# EAGLE design ezo_single_smaller (EAGLE 9.6.2)
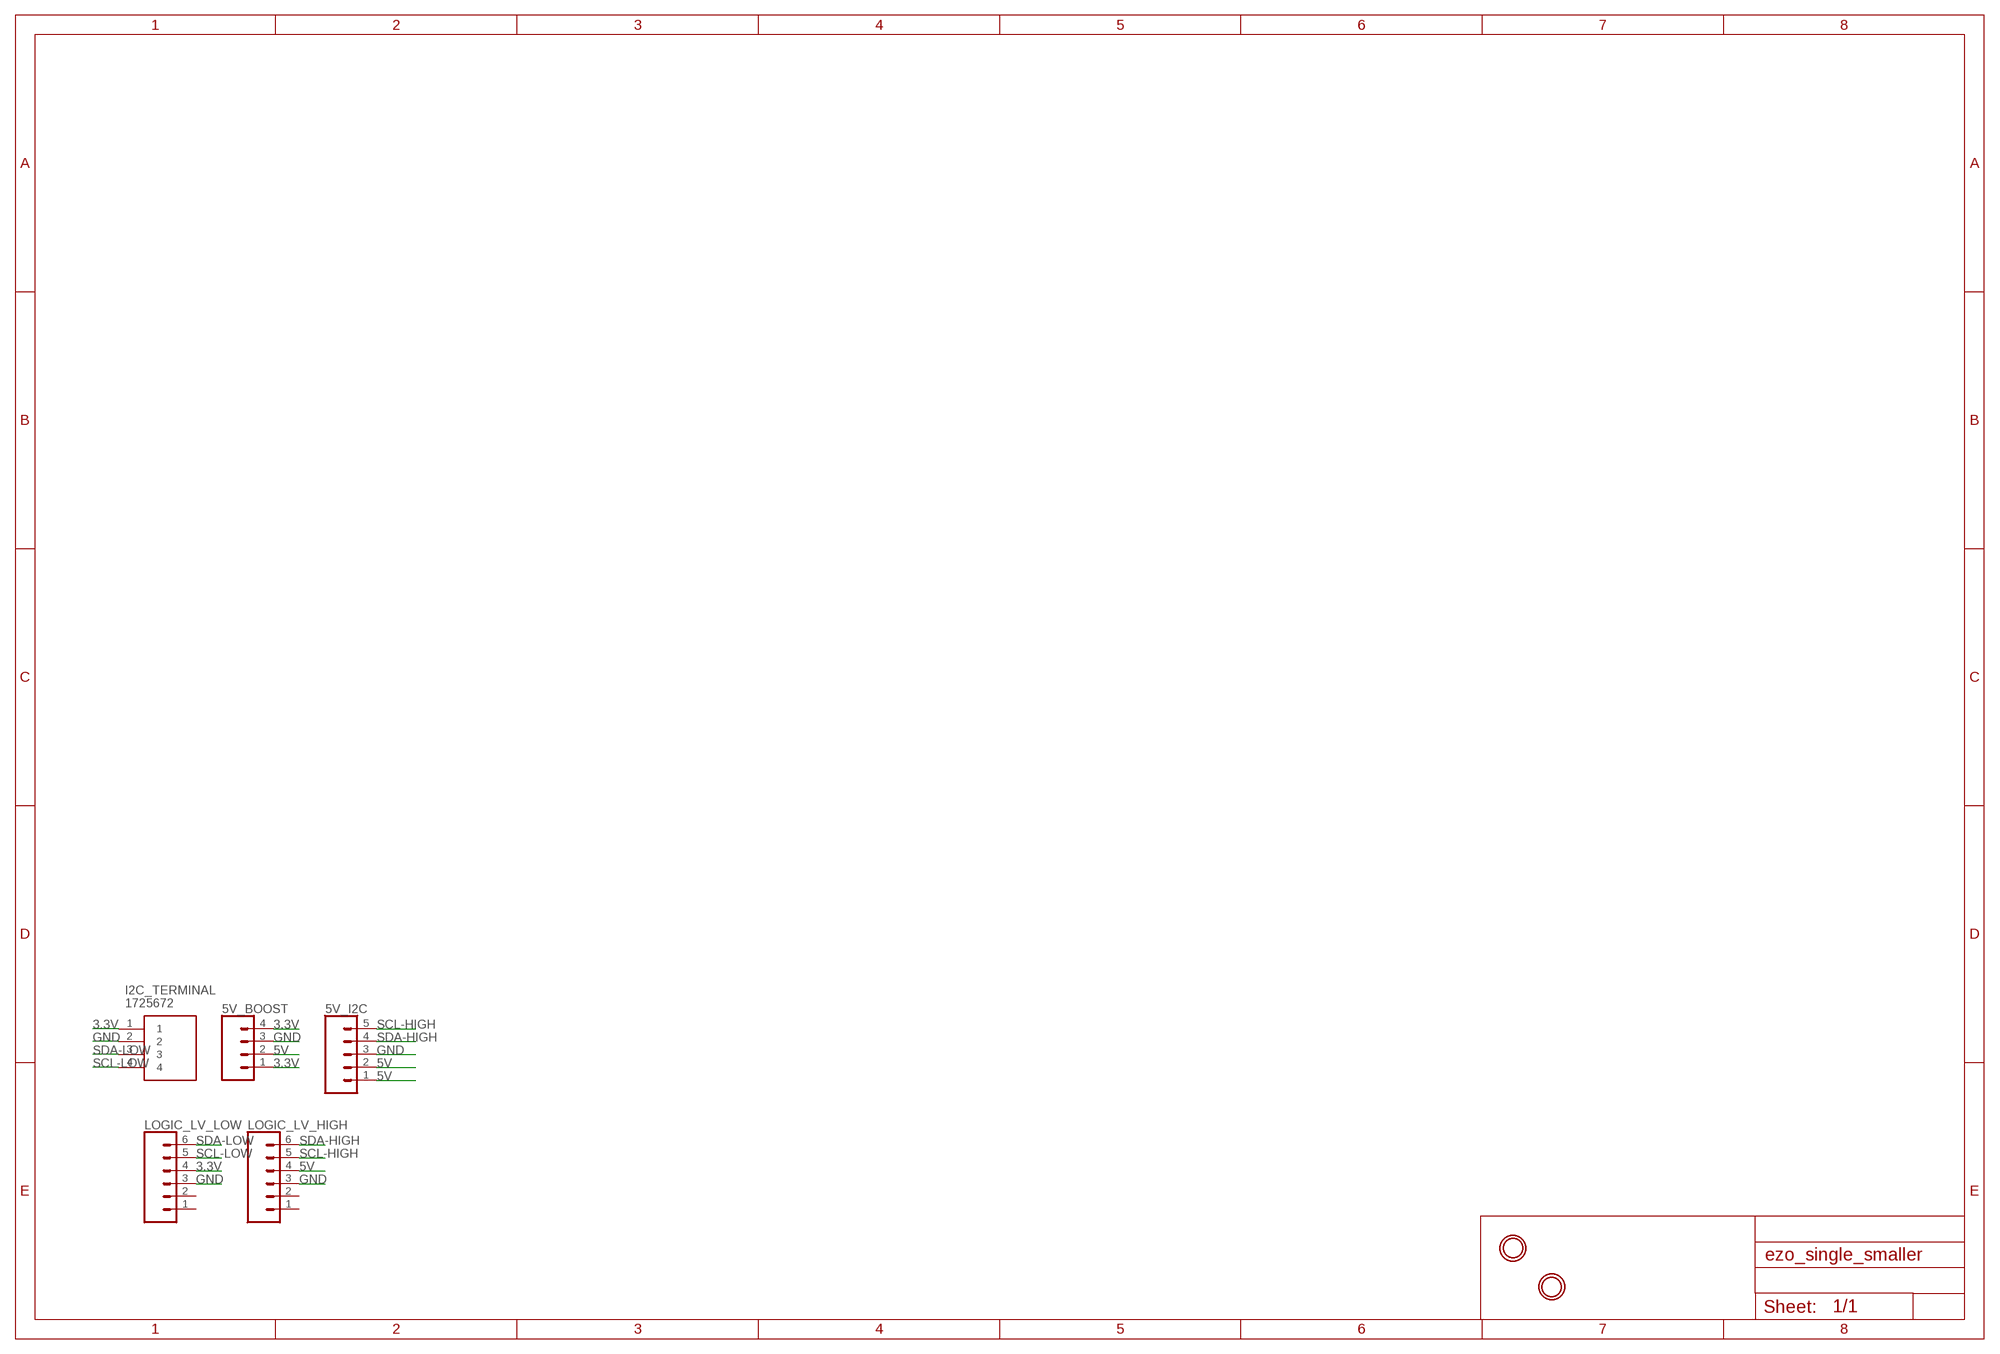
[diagram p0: schematic, sheet 1]

## Parts
5V_BOOST  CONN_04PTH  [1X04]
5V_I2C  CONN_05PTH  [1X05]
I2C_TERMINAL  1725672  [1725672]
LOGIC_LV_HIGH  CONN_06SILK_FEMALE_PTH  [1X06]
LOGIC_LV_LOW  CONN_06SILK_FEMALE_PTH  [1X06]
U$1  MOUNTINGHOLE2.5  [MOUNTINGHOLE_2.5_PLATED]
U$3  MOUNTINGHOLE2.5  [MOUNTINGHOLE_2.5_PLATED]

## Nets
3.3V: 5V_BOOST.1 5V_BOOST.4 I2C_TERMINAL.1 LOGIC_LV_LOW.4
5V: 5V_BOOST.2 5V_I2C.1 5V_I2C.2 LOGIC_LV_HIGH.4
GND: 5V_BOOST.3 5V_I2C.3 I2C_TERMINAL.2 LOGIC_LV_HIGH.3 LOGIC_LV_LOW.3
SCL-HIGH: 5V_I2C.5 LOGIC_LV_HIGH.5
SCL-LOW: I2C_TERMINAL.4 LOGIC_LV_LOW.5
SDA-HIGH: 5V_I2C.4 LOGIC_LV_HIGH.6
SDA-LOW: I2C_TERMINAL.3 LOGIC_LV_LOW.6
Unconnected: LOGIC_LV_HIGH.1 LOGIC_LV_HIGH.2 LOGIC_LV_LOW.1 LOGIC_LV_LOW.2

## Library data of the parts
5V_BOOST = SparkFun-Connectors:CONN_04: Multi connection point. Often used as Generic Header-pin footprint for 0.1 inch spaced/style header connections On any of the 0.1 inch spaced packages, you can populate with these: Break Away Headers - Straight <https://www.sparkfun.com/products/116> (PRT-00116) Break Away Male Headers - Right Angle <https://www.sparkfun.com/products/553> (PRT-00553) Female Headers <https://www.sparkfun.com/products/115> (PRT-00115) Break Away Headers - Machine Pin <https://www.sparkfun.com/products/117> (PRT-00117) Break Away Female Headers - Swiss Machine Pin <https://www.sparkfun.com/products/743> (PRT-00743) For SCREWTERMINALS and SPRING TERMINALS visit here: Screw Terimnals on SparkFun.com <https://www.sparkfun.com/search/results?term=Screw+Terminals> (5mm/3.5mm/2.54mm spacing) This device is also useful as a general connection point to wire up your design to another part of your project. Our various solder wires solder well into these plated through hole pads. Hook-Up Wire - Assortment (Stranded, 22 AWG) <https://www.sparkfun.com/products/11375> (PRT-11375) Hook-Up Wire - Assortment (Solid Core, 22 AWG) <https://www.sparkfun.com/products/11367> (PRT-11367) View the entire wire category on our website here <https://www.sparkfun.com/categories/141> Special notes: Molex polarized connector foot print use with SKU : PRT-08231 with associated crimp pins and housings. 1MM SMD Version SKU: PRT-10208; PROD_ID: CONN-09696
5V_I2C = SparkFun-Connectors:CONN_05: Multi connection point. Often used as Generic Header-pin footprint for 0.1 inch spaced/style header connections On any of the 0.1 inch spaced packages, you can populate with these: Break Away Headers - Straight <https://www.sparkfun.com/products/116> (PRT-00116) Break Away Male Headers - Right Angle <https://www.sparkfun.com/products/553> (PRT-00553) Female Headers <https://www.sparkfun.com/products/115> (PRT-00115) Break Away Headers - Machine Pin <https://www.sparkfun.com/products/117> (PRT-00117) Break Away Female Headers - Swiss Machine Pin <https://www.sparkfun.com/products/743> (PRT-00743) For SCREWTERMINALS and SPRING TERMINALS visit here: Screw Terimnals on SparkFun.com <https://www.sparkfun.com/search/results?term=Screw+Terminals> (5mm/3.5mm/2.54mm spacing) This device is also useful as a general connection point to wire up your design to another part of your project. Our various solder wires solder well into these plated through hole pads. Hook-Up Wire - Assortment (Stranded, 22 AWG) <https://www.sparkfun.com/products/11375> (PRT-11375) Hook-Up Wire - Assortment (Solid Core, 22 AWG) <https://www.sparkfun.com/products/11367> (PRT-11367) View the entire wire category on our website here <https://www.sparkfun.com/categories/141> Special notes: Molex polarized connector foot print use with SKU : PRT-08231 with associated crimp pins and housings. 1MM SMD Version SKU: PRT-10208
I2C_TERMINAL = 4pin_screw:1725672: 4 way vertical PCB terminal,6A 63V Phoenix Contact Non-Fused Terminal Block, 4 Way, Solder Terminals, 26 ??? 20 AWG Through Hole, Nylon, 63 V Source: Datasheet <https://datasheet.datasheetarchive.com/originals/distributors/SFDatasheet-2/sf-00050602.pdf>; DESCRIPTION: 4 way vertical PCB terminal,6A 63V Phoenix Contact Non-Fused Terminal Block, 4 Way, Solder Terminals, 26 ??? 20 AWG Through Hole, Nylon, 63 V; HEIGHT: 8.65mm; MANUFACTURER_NAME: Phoenix Contact; MANUFACTURER_PART_NUMBER: 1725672; MOUSER_PART_NUMBER: 651-1725672; MOUSER_PRICE-STOCK: https://www.mouser.co.uk/ProductDetail/Phoenix-Contact/1725672?qs=Ul7CXFMnlWXX93F9bOV2pQ%3D%3D
LOGIC_LV_HIGH LOGIC_LV_LOW = SparkFun-Connectors:CONN_06: Multi connection point. Often used as Generic Header-pin footprint for 0.1 inch spaced/style header connections On any of the 0.1 inch spaced packages, you can populate with these: Break Away Headers - Straight <https://www.sparkfun.com/products/116> (PRT-00116) Break Away Male Headers - Right Angle <https://www.sparkfun.com/products/553> (PRT-00553) Female Headers <https://www.sparkfun.com/products/115> (PRT-00115) Break Away Headers - Machine Pin <https://www.sparkfun.com/products/117> (PRT-00117) Break Away Female Headers - Swiss Machine Pin <https://www.sparkfun.com/products/743> (PRT-00743) Arduino Stackable Header - 6 Pin <https://www.sparkfun.com/products/9280> (PRT-09280) Screw Terminals 2.54mm Pitch (6-Pin) <https://www.sparkfun.com/products/16499> (PRT-16499) For SCREWTERMINALS and SPRING TERMINALS visit here: Screw Terimnals on SparkFun.com <https://www.sparkfun.com/search/results?term=Screw+Terminals> (5mm/3.5mm/2.54mm spacing) This device is also useful as a general connection point to wire up your design to another part of your project. Our various solder wires solder well into these plated through hole pads. Hook-Up Wire - Assortment (Stranded, 22 AWG) <https://www.sparkfun.com/products/11375> (PRT-11375) Hook-Up Wire - Assortment (Solid Core, 22 AWG) <https://www.sparkfun.com/products/11367> (PRT-11367) View the entire wire category on our website here <https://www.sparkfun.com/categories/141>; PROD_ID: CONN-08437
U$1 U$3 = microbuilder:MOUNTINGHOLE: Mounting Hole For #2 screws (0.086"/2.18mm width, 0.094"/2.4mm hole) use 2.5mm

## Board
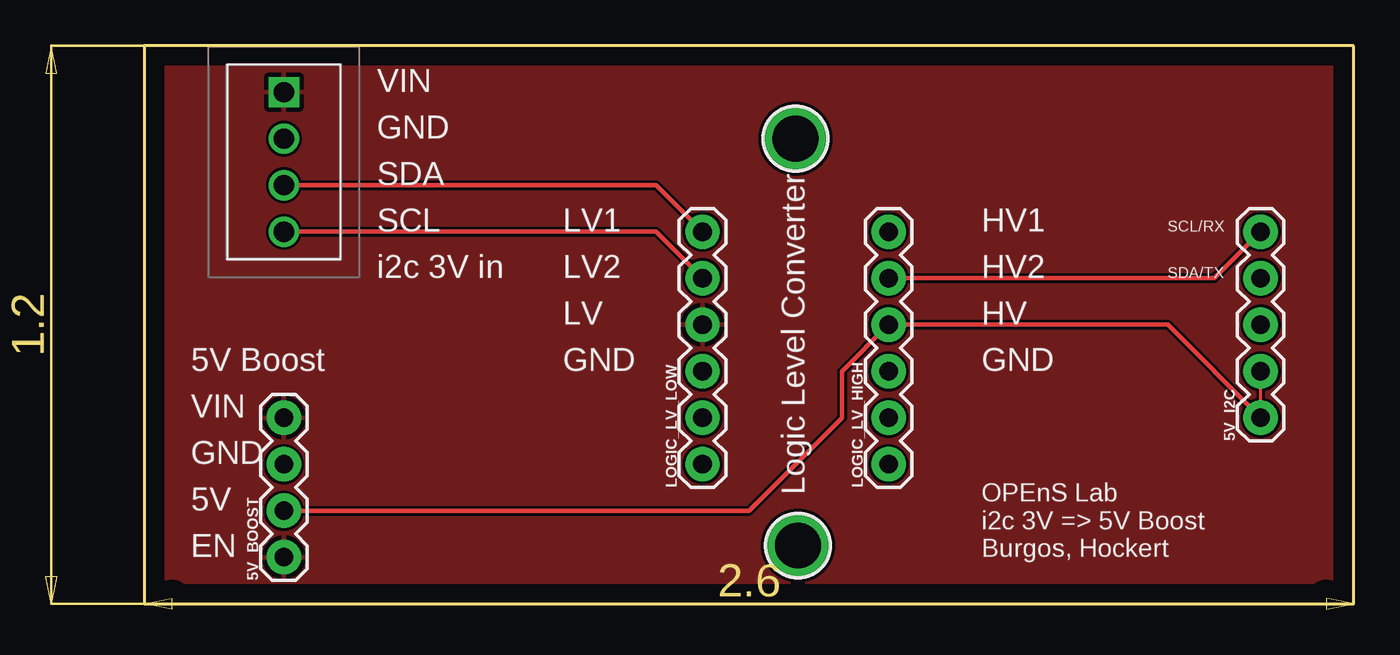
[diagram p1: board, top side]
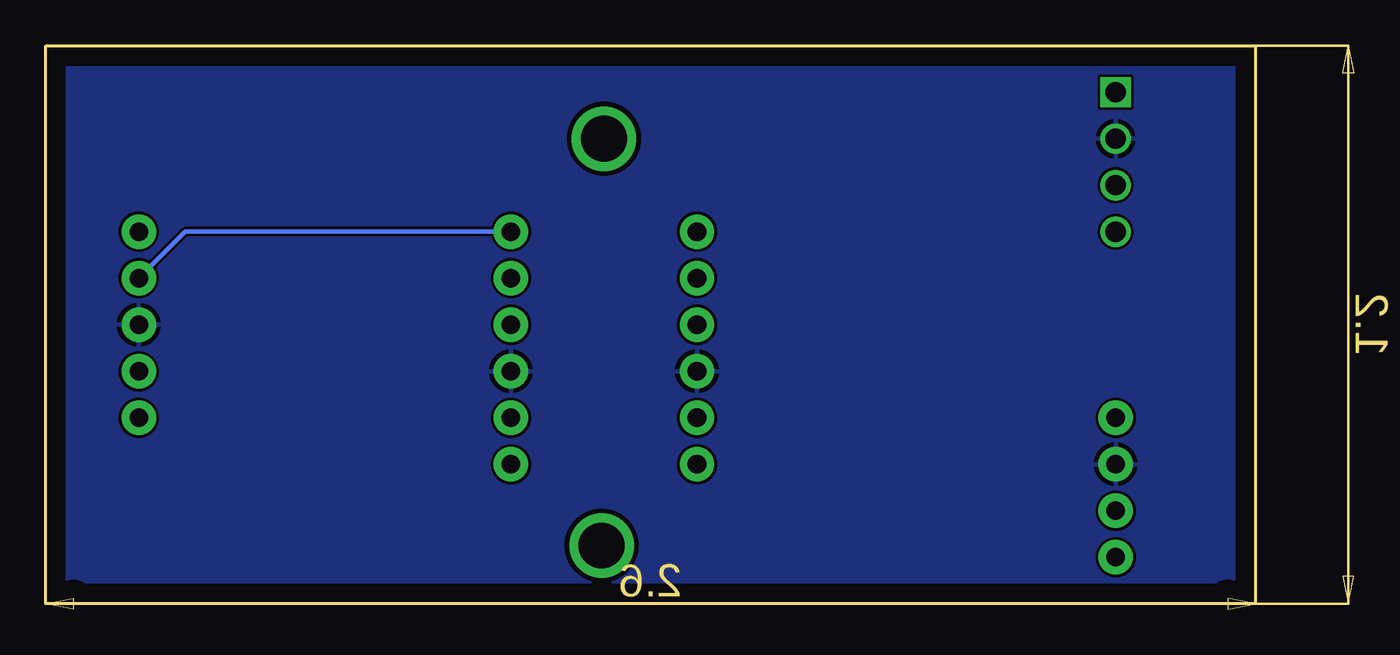
[diagram p2: board, bottom side, seen from below]

Size 66.04 x 30.48 mm. Coordinates in mm from the lower left corner, seen from the top.
Outline: 0,0 66.04,0 66.04,30.48 0,30.48 0,0
Copper layers (1*16): Top 0.035mm / dielectric 1.5mm / Bottom 0.035mm
Design rules "default": minimum track width 6mil, minimum drill 0.35mm, track to track 6mil, track to pad 6mil, pad to pad 6mil, via to via 6mil, smd to smd 6mil, copper to edge 40mil, drill to drill 6mil, minimum pad ring 10mil, minimum via ring 8mil, stop-mask expansion 4mil, vias tented up to drill 0mil, thermal gap 10mil

### Footprints (pad centres in the part's own frame; a part is rotated, then mirrored left to right if it is on the bottom)
1X04 = drill 1.016 pad 1.88: 1 0,0; 2 2.54,0; 3 5.08,0; 4 7.62,0
1X05 = drill 1.016 pad 1.88: 1 0,0; 2 2.54,0; 3 5.08,0; 4 7.62,0; 5 10.16,0
1725672 = drill 1.1 pad 1.65 square: 1 0,0 | drill 1.1 pad 1.65: 2 2.54,0; 3 5.08,0; 4 7.62,0
1X06 = drill 1.016 pad 1.88: 1 0,0; 2 2.54,0; 3 5.08,0; 4 7.62,0; 5 10.16,0; 6 12.7,0
MOUNTINGHOLE_2.5_PLATED = drill 2.5 pad 3.2: P$1 0,0

### Placement (x,y rotation side)
5V_BOOST  7.62,2.54 90 top
5V_I2C  60.96,10.16 90 top
I2C_TERMINAL  7.62,27.94 270 top
LOGIC_LV_HIGH  40.64,7.62 90 top
LOGIC_LV_LOW  30.48,7.62 90 top
U$1  35.69,3.17 0 top
U$3  35.56,25.4 90 top

### Tracks (layer width: path | path; a pad name or v marks a point on that pad's centre or on a via)
3.3V
  pour Top: 0,30.48 66.04,30.48 66.04,0 0,0
5V
  Top 0.152: 5V_I2C.1 5V_I2C.2
  Top 0.254: 5V_BOOST.2 33.02,5.08 38.1,10.16 38.1,12.7 LOGIC_LV_HIGH.4 55.88,15.24 5V_I2C.1
GND
  pour Bottom: 0,30.48 66.04,30.48 66.04,0 0,0
SCL-HIGH
  Top 0.254: LOGIC_LV_HIGH.5 58.42,17.78 5V_I2C.5
SCL-LOW
  Top 0.254: I2C_TERMINAL.4 27.94,20.32 LOGIC_LV_LOW.5
SDA-HIGH
  Bottom 0.254: LOGIC_LV_HIGH.6 58.42,20.32 5V_I2C.4
SDA-LOW
  Top 0.254: I2C_TERMINAL.3 27.94,22.86 LOGIC_LV_LOW.6

### Text on the board
tPlace: VIN | GND | SDA | SCL | LV1 | HV1 | SCL/RX | i2c 3V in | LV2 | HV2 | SDA/TX | LV | HV | 5V Boost | GND | GND | VIN | GND | Logic Level Converter | 5V | EN | OPEnS Lab / i2c 3V => 5V Boost / Burgos, Hockert